# Altium schematic sheet Servo2.SchDoc
size 420 x 297 mm; SheetNumber: 15; SheetTotal: 32
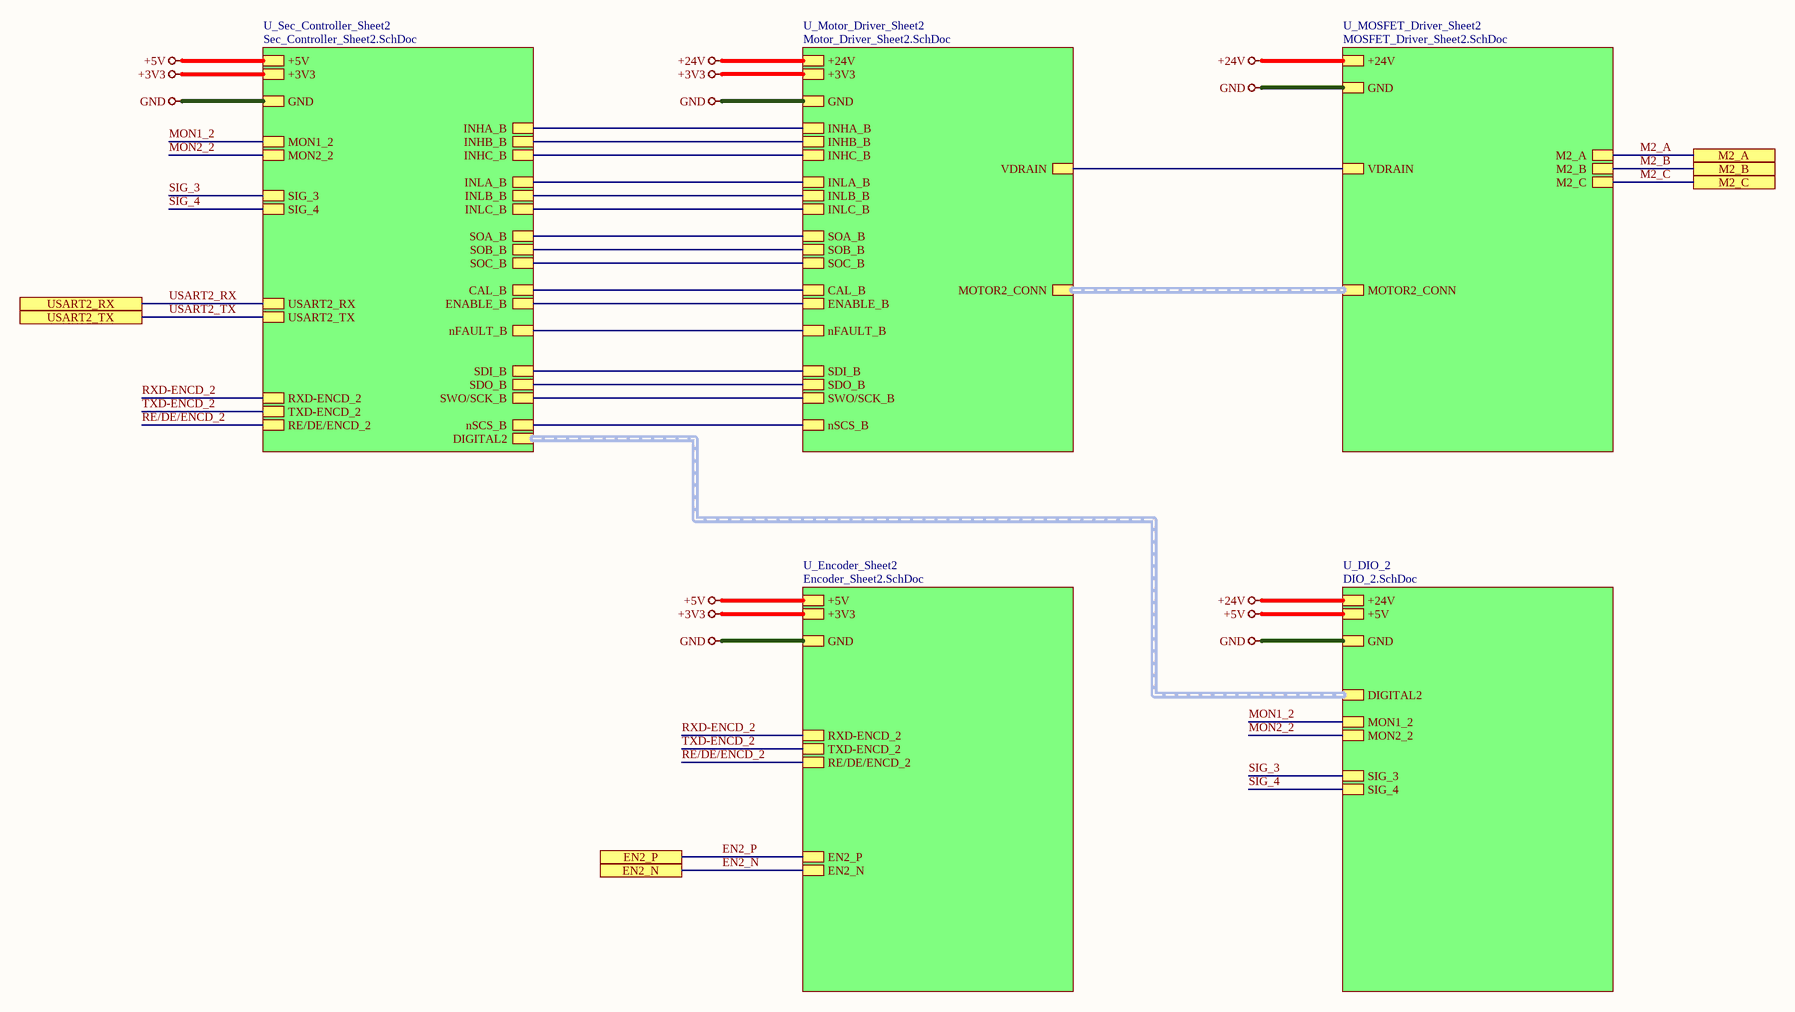
[diagram p0: Servo2.SchDoc]

## Sub-sheets
U_DIO_2 = DIO_2.SchDoc: +24V, +5V, GND, MON1_2, MON2_2, SIG_3, SIG_4, DIGITAL2 (harness DIGITAL1)
U_Encoder_Sheet2 = Encoder_Sheet2.SchDoc: +3V3, +5V, GND, EN2_N, EN2_P, RXD-ENCD_2, TXD-ENCD_2, RE/DE/ENCD_2
U_MOSFET_Driver_Sheet2 = MOSFET_Driver_Sheet2.SchDoc: +24V, GND, M2_A, M2_B, M2_C, MOTOR2_CONN (harness MOTOR2_CONN), VDRAIN
U_Motor_Driver_Sheet2 = Motor_Driver_Sheet2.SchDoc: +24V, +3V3, GND, MOTOR2_CONN (harness MOTOR2_CONN), INHA_B, INHB_B, INHC_B, INLA_B, INLB_B, INLC_B, nSCS_B, SDI_B, SDO_B, SWO/SCK_B, SOC_B, SOB_B, SOA_B, CAL_B, ENABLE_B, VDRAIN, nFAULT_B
U_Sec_Controller_Sheet2 = Sec_Controller_Sheet2.SchDoc: +3V3, GND, INHA_B, INHB_B, INHC_B, INLA_B, INLB_B, INLC_B, nSCS_B, SDI_B, SDO_B, SWO/SCK_B, SOC_B, SOB_B, SOA_B, CAL_B, ENABLE_B, nFAULT_B, USART2_RX, USART2_TX, RXD-ENCD_2, TXD-ENCD_2, RE/DE/ENCD_2, DIGITAL2 (harness DIGITAL1), MON1_2, MON2_2, SIG_3, SIG_4, +5V

## Ports
EN2_N (see Top_Sheet[6A], Connector_Sheet[3D], Encoder_Sheet2[2D]), EN2_P (see Top_Sheet[6A], Connector_Sheet[3D], Encoder_Sheet2[2D]), M2_A (see Top_Sheet[6B], Connector_Sheet[4D], MOSFET_Driver_Sheet2[3D]), M2_B (see Top_Sheet[6B], Connector_Sheet[4D], MOSFET_Driver_Sheet2[3D]), M2_C (see Top_Sheet[6B], Connector_Sheet[4D], MOSFET_Driver_Sheet2[3D]), USART2_RX (see Top_Sheet[6A], Controller_Sheet[2D], Sec_Controller_Sheet2[1D]), USART2_TX (see Top_Sheet[6A], Controller_Sheet[2D], Sec_Controller_Sheet2[1D])

## Nets
+3V3: sheet U_Sec_Controller_Sheet2/+3V3, sheet U_Motor_Driver_Sheet2/+3V3, sheet U_Encoder_Sheet2/+3V3
+5V: sheet U_Sec_Controller_Sheet2/+5V, sheet U_Encoder_Sheet2/+5V, sheet U_DIO_2/+5V
+24V: sheet U_MOSFET_Driver_Sheet2/+24V, sheet U_Motor_Driver_Sheet2/+24V, sheet U_DIO_2/+24V
GND: sheet U_Sec_Controller_Sheet2/GND, sheet U_MOSFET_Driver_Sheet2/GND, sheet U_Motor_Driver_Sheet2/GND, sheet U_Encoder_Sheet2/GND, sheet U_DIO_2/GND
EN2_N: port EN2_N, sheet U_Encoder_Sheet2/EN2_N
EN2_P: port EN2_P, sheet U_Encoder_Sheet2/EN2_P
M2_A: port M2_A, sheet U_MOSFET_Driver_Sheet2/M2_A
M2_B: port M2_B, sheet U_MOSFET_Driver_Sheet2/M2_B
M2_C: port M2_C, sheet U_MOSFET_Driver_Sheet2/M2_C
MON1_2: sheet U_Sec_Controller_Sheet2/MON1_2, sheet U_DIO_2/MON1_2
MON2_2: sheet U_Sec_Controller_Sheet2/MON2_2, sheet U_DIO_2/MON2_2
RE/DE/ENCD_2: sheet U_Sec_Controller_Sheet2/RE/DE/ENCD_2, sheet U_Encoder_Sheet2/RE/DE/ENCD_2
RXD-ENCD_2: sheet U_Sec_Controller_Sheet2/RXD-ENCD_2, sheet U_Encoder_Sheet2/RXD-ENCD_2
SIG_3: sheet U_Sec_Controller_Sheet2/SIG_3, sheet U_DIO_2/SIG_3
SIG_4: sheet U_Sec_Controller_Sheet2/SIG_4, sheet U_DIO_2/SIG_4
TXD-ENCD_2: sheet U_Sec_Controller_Sheet2/TXD-ENCD_2, sheet U_Encoder_Sheet2/TXD-ENCD_2
USART2_RX: port USART2_RX, sheet U_Sec_Controller_Sheet2/USART2_RX
USART2_TX: port USART2_TX, sheet U_Sec_Controller_Sheet2/USART2_TX
(unnamed): sheet U_Sec_Controller_Sheet2/INHA_B, sheet U_Motor_Driver_Sheet2/INHA_B
(unnamed): sheet U_Sec_Controller_Sheet2/INHB_B, sheet U_Motor_Driver_Sheet2/INHB_B
(unnamed): sheet U_Sec_Controller_Sheet2/INHC_B, sheet U_Motor_Driver_Sheet2/INHC_B
(unnamed): sheet U_Sec_Controller_Sheet2/INLA_B, sheet U_Motor_Driver_Sheet2/INLA_B
(unnamed): sheet U_Sec_Controller_Sheet2/INLB_B, sheet U_Motor_Driver_Sheet2/INLB_B
(unnamed): sheet U_Sec_Controller_Sheet2/INLC_B, sheet U_Motor_Driver_Sheet2/INLC_B
(unnamed): sheet U_Sec_Controller_Sheet2/nSCS_B, sheet U_Motor_Driver_Sheet2/nSCS_B
(unnamed): sheet U_Sec_Controller_Sheet2/SDI_B, sheet U_Motor_Driver_Sheet2/SDI_B
(unnamed): sheet U_Sec_Controller_Sheet2/SDO_B, sheet U_Motor_Driver_Sheet2/SDO_B
(unnamed): sheet U_Sec_Controller_Sheet2/SWO/SCK_B, sheet U_Motor_Driver_Sheet2/SWO/SCK_B
(unnamed): sheet U_Sec_Controller_Sheet2/SOC_B, sheet U_Motor_Driver_Sheet2/SOC_B
(unnamed): sheet U_Sec_Controller_Sheet2/SOB_B, sheet U_Motor_Driver_Sheet2/SOB_B
(unnamed): sheet U_Sec_Controller_Sheet2/SOA_B, sheet U_Motor_Driver_Sheet2/SOA_B
(unnamed): sheet U_Sec_Controller_Sheet2/CAL_B, sheet U_Motor_Driver_Sheet2/CAL_B
(unnamed): sheet U_Sec_Controller_Sheet2/ENABLE_B, sheet U_Motor_Driver_Sheet2/ENABLE_B
(unnamed): sheet U_Sec_Controller_Sheet2/nFAULT_B, sheet U_Motor_Driver_Sheet2/nFAULT_B
(unnamed): sheet U_MOSFET_Driver_Sheet2/VDRAIN, sheet U_Motor_Driver_Sheet2/VDRAIN

## Buses and harness runs
harness sheet U_DIO_2/DIGITAL2 = sheet U_Sec_Controller_Sheet2/DIGITAL2
harness sheet U_MOSFET_Driver_Sheet2/MOTOR2_CONN = sheet U_Motor_Driver_Sheet2/MOTOR2_CONN

## Notes on the sheet
- File:
- Title:
- Date:
- Page
- Num:
- Total:
- Drawn By: Huzaifa Ali